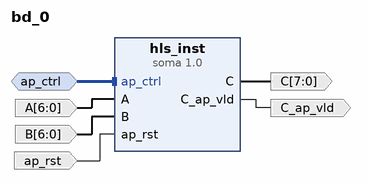
[diagram p0: block diagram of the top level]
# Vivado block design bd_0, xc7z007sclg400-1, Vivado 2024.2
create_bd_design bd_0

create_bd_intf_port -mode Slave -vlnv xilinx.com:interface:acc_handshake_rtl:1.0 ap_ctrl
create_bd_port -dir I -from 6 -to 0 -type data A
create_bd_port -dir I -from 6 -to 0 -type data B
create_bd_port -dir O -from 7 -to 0 -type data C
create_bd_port -dir O C_ap_vld
create_bd_port -dir I -type rst ap_rst
set_property -dict {CONFIG.POLARITY ACTIVE_HIGH} [get_bd_ports ap_rst]

create_bd_cell -type ip -vlnv xilinx.com:hls:soma:1.0 hls_inst

# ---- connections ----

connect_bd_intf_net -intf_net ap_ctrl_0_1 [get_bd_intf_ports ap_ctrl] [get_bd_intf_pins hls_inst/ap_ctrl]
connect_bd_net -net A_0_1 [get_bd_ports A] [get_bd_pins hls_inst/A]
connect_bd_net -net B_0_1 [get_bd_ports B] [get_bd_pins hls_inst/B]
connect_bd_net -net ap_rst_0_1 [get_bd_ports ap_rst] [get_bd_pins hls_inst/ap_rst]
connect_bd_net [get_bd_pins hls_inst/C] [get_bd_ports C]
connect_bd_net [get_bd_pins hls_inst/C_ap_vld] [get_bd_ports C_ap_vld]

validate_bd_design
save_bd_design
